# Altium project FBK Controll system Project.PrjPcb
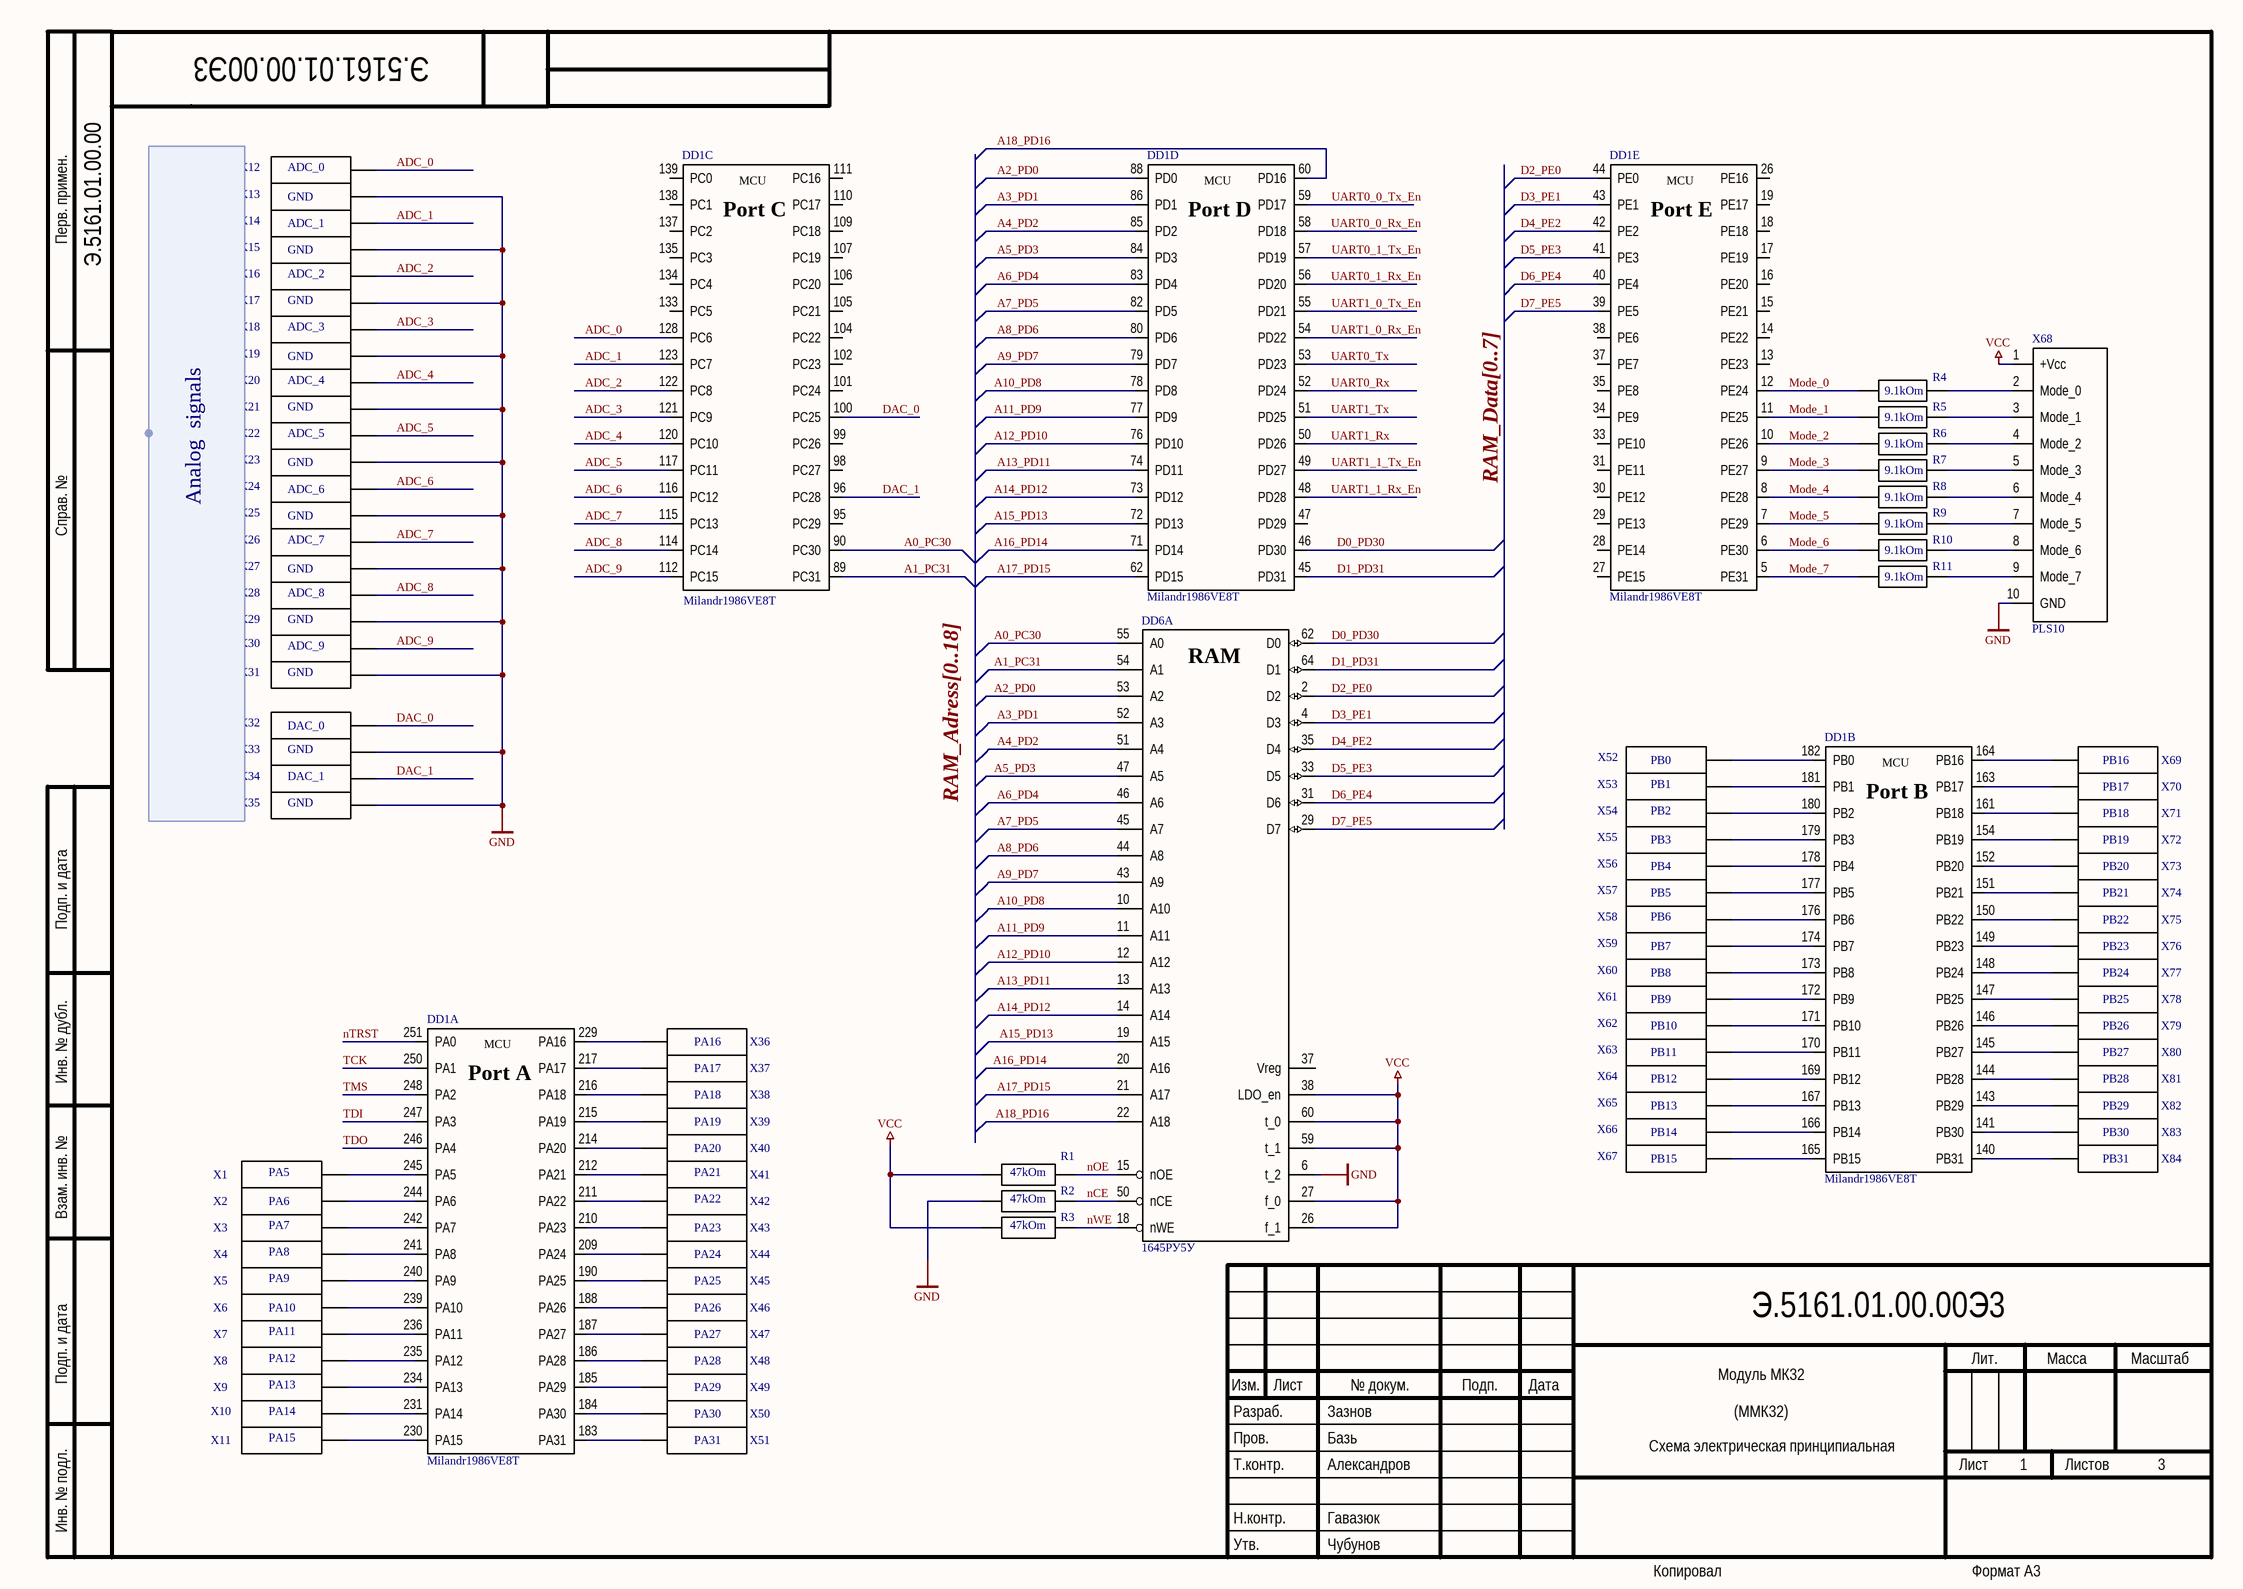
[diagram p0: MK32.SchDoc]
3 sheets, 248 parts. Net scope: global (net labels, ports and power ports of the same name join across sheets).
Board file: MK32.PcbDoc
Sheets:
  MK32.SchDoc
  MK32_2.SchDoc
  MK32_3.SchDoc

## Sheet MK32.SchDoc: Модуль МК32
size 420 x 297 mm; ApprovedBy: Чубунов; CheckedBy: Базь; Author: Зазнов; DocumentNumber: Э.5161.01.00.00Э3; SheetNumber: 1; SheetTotal: 3; NormInspection: Гавазюк; ProcessInspection: Александров; Title2str: (ММК32); DocumentType: Схема электрическая принципиальная; FirstReferrence: Э.5161.01.00.00

### Parts
(Parts that share a designator on the sheet are numbered #1, #2 ... from top to bottom, then left to right.)
DD1#1  Milandr1986VE8T  [4244.256-3]  (parts A,B,C,D,E of 6)
DD6  1645РУ5У  [5134.64-6]  (part A of 2)
R1  47kOm  [C 0603]
R2  47kOm  [C 0603]
R3  47kOm  [C 0603]
R4  9.1kOm  [C 0603]
R5  9.1kOm  [C 0603]
R6  9.1kOm  [C 0603]
R7  9.1kOm  [C 0603]
R8  9.1kOm  [C 0603]
R9  9.1kOm  [C 0603]
R10  9.1kOm  [C 0603]
R11  9.1kOm  [C 0603]
X1  PA5  [PL]
X2  PA6  [PL]
X3  PA7  [PL]
X4  PA8  [PL]
X5  PA9  [PL]
X6  PA10  [PL]
X7  PA11  [PL]
X8  PA12  [PL]
X9  PA13  [PL]
X10  PA14  [PL]
X11  PA15  [PL]
X12  ADC_0  [PL]
X13  GND  [PL]
X14  ADC_1  [PL]
X15  GND  [PL]
X16  ADC_2  [PL]
X17  GND  [PL]
X18  ADC_3  [PL]
X19  GND  [PL]
X20  ADC_4  [PL]
X21  GND  [PL]
X22  ADC_5  [PL]
X23  GND  [PL]
X24  ADC_6  [PL]
X25  GND  [PL]
X26  ADC_7  [PL]
X27  GND  [PL]
X28  ADC_8  [PL]
X29  GND  [PL]
X30  ADC_9  [PL]
X31  GND  [PL]
X32  DAC_0  [PL]
X33  GND  [PL]
X34  DAC_1  [PL]
X35  GND  [PL]
X36  PA16  [PL]
X37  PA17  [PL]
X38  PA18  [PL]
X39  PA19  [PL]
X40  PA20  [PL]
X41  PA21  [PL]
X42  PA22  [PL]
X43  PA23  [PL]
X44  PA24  [PL]
X45  PA25  [PL]
X46  PA26  [PL]
X47  PA27  [PL]
X48  PA28  [PL]
X49  PA29  [PL]
X50  PA30  [PL]
X51  PA31  [PL]
X52  PB0  [PL]
X53  PB1  [PL]
X54  PB2  [PL]
X55  PB3  [PL]
X56  PB4  [PL]
X57  PB5  [PL]
X58  PB6  [PL]
X59  PB7  [PL]
X60  PB8  [PL]
X61  PB9  [PL]
X62  PB10  [PL]
X63  PB11  [PL]
X64  PB12  [PL]
X65  PB13  [PL]
X66  PB14  [PL]
X67  PB15  [PL]
X68  PLS10  [PLS10]
X69  PB16  [PL]
X70  PB17  [PL]
X71  PB18  [PL]
X72  PB19  [PL]
X73  PB20  [PL]
X74  PB21  [PL]
X75  PB22  [PL]
X76  PB23  [PL]
X77  PB24  [PL]
X78  PB25  [PL]
X79  PB26  [PL]
X80  PB27  [PL]
X81  PB28  [PL]
X82  PB29  [PL]
X83  PB30  [PL]
X84  PB31  [PL]

### Harnesses
Analog  signals: 

### Nets
GND: DD6.6(t_2) R2.2 X13.?1(name) X15.?1(name) X17.?1(name) X19.?1(name) X21.?1(name) X23.?1(name) X25.?1(name) X27.?1(name) X29.?1(name) X31.?1(name) X33.?1(name) X35.?1(name) X68.10(GND)
VCC: DD6.26(f_1) DD6.27(f_0) DD6.38(LDO_en) DD6.59(t_1) DD6.60(t_0) R1.2 R3.2 X68.1(+Vcc)
A0_PC30: DD1#1.90(PC30) DD6.55(A0)
A1_PC31: DD1#1.89(PC31) DD6.54(A1)
A2_PD0: DD1#1.88(PD0) DD6.53(A2)
A3_PD1: DD1#1.86(PD1) DD6.52(A3)
A4_PD2: DD1#1.85(PD2) DD6.51(A4)
A5_PD3: DD1#1.84(PD3) DD6.47(A5)
A6_PD4: DD1#1.83(PD4) DD6.46(A6)
A7_PD5: DD1#1.82(PD5) DD6.45(A7)
A8_PD6: DD1#1.80(PD6) DD6.44(A8)
A9_PD7: DD1#1.79(PD7) DD6.43(A9)
A10_PD8: DD1#1.78(PD8) DD6.10(A10)
A11_PD9: DD1#1.77(PD9) DD6.11(A11)
A12_PD10: DD1#1.76(PD10) DD6.12(A12)
A13_PD11: DD1#1.74(PD11) DD6.13(A13)
A14_PD12: DD1#1.73(PD12) DD6.14(A14)
A15_PD13: DD1#1.72(PD13) DD6.19(A15)
A16_PD14: DD1#1.71(PD14) DD6.20(A16)
A17_PD15: DD1#1.62(PD15) DD6.21(A17)
A18_PD16: DD1#1.60(PD16) DD6.22(A18)
ADC_0: DD1#1.128(PC6) X12.?1(name)
ADC_1: DD1#1.123(PC7) X14.?1(name)
ADC_2: DD1#1.122(PC8) X16.?1(name)
ADC_3: DD1#1.121(PC9) X18.?1(name)
ADC_4: DD1#1.120(PC10) X20.?1(name)
ADC_5: DD1#1.117(PC11) X22.?1(name)
ADC_6: DD1#1.116(PC12) X24.?1(name)
ADC_7: DD1#1.115(PC13) X26.?1(name)
ADC_8: DD1#1.114(PC14) X28.?1(name)
ADC_9: DD1#1.112(PC15) X30.?1(name)
D0_PD30: DD1#1.46(PD30) DD6.62(D0)
D1_PD31: DD1#1.45(PD31) DD6.64(D1)
D2_PE0: DD1#1.44(PE0) DD6.2(D2)
D3_PE1: DD1#1.43(PE1) DD6.4(D3)
D4_PE2: DD1#1.42(PE2) DD6.35(D4)
D5_PE3: DD1#1.41(PE3) DD6.33(D5)
D6_PE4: DD1#1.40(PE4) DD6.31(D6)
D7_PE5: DD1#1.39(PE5) DD6.29(D7)
DAC_0: DD1#1.100(PC25) X32.?1(name)
DAC_1: DD1#1.96(PC28) X34.?1(name)
Mode_0: DD1#1.12(PE24) R4.1
Mode_1: DD1#1.11(PE25) R5.1
Mode_2: DD1#1.10(PE26) R6.1
Mode_3: DD1#1.9(PE27) R7.1
Mode_4: DD1#1.8(PE28) R8.1
Mode_5: DD1#1.7(PE29) R9.1
Mode_6: DD1#1.6(PE30) R10.1
Mode_7: DD1#1.5(PE31) R11.1
nCE: DD6.50(nCE) R2.1
nOE: DD6.15(nOE) R1.1
nTRST: DD1#1.251(PA0)
nWE: DD6.18(nWE) R3.1
TCK: DD1#1.250(PA1)
TDI: DD1#1.247(PA3)
TDO: DD1#1.246(PA4)
TMS: DD1#1.248(PA2)
UART0_0_Rx_En: DD1#1.58(PD18)
UART0_0_Tx_En: DD1#1.59(PD17)
UART0_1_Rx_En: DD1#1.56(PD20)
UART0_1_Tx_En: DD1#1.57(PD19)
UART0_Rx: DD1#1.52(PD24)
UART0_Tx: DD1#1.53(PD23)
UART1_0_Rx_En: DD1#1.54(PD22)
UART1_0_Tx_En: DD1#1.55(PD21)
UART1_1_Rx_En: DD1#1.48(PD28)
UART1_1_Tx_En: DD1#1.49(PD27)
UART1_Rx: DD1#1.50(PD26)
UART1_Tx: DD1#1.51(PD25)
NetDD1#1_140: DD1#1.140(PB31) X84.?1(name)
NetDD1#1_141: DD1#1.141(PB30) X83.?1(name)
NetDD1#1_143: DD1#1.143(PB29) X82.?1(name)
NetDD1#1_144: DD1#1.144(PB28) X81.?1(name)
NetDD1#1_145: DD1#1.145(PB27) X80.?1(name)
NetDD1#1_146: DD1#1.146(PB26) X79.?1(name)
NetDD1#1_147: DD1#1.147(PB25) X78.?1(name)
NetDD1#1_148: DD1#1.148(PB24) X77.?1(name)
NetDD1#1_149: DD1#1.149(PB23) X76.?1(name)
NetDD1#1_150: DD1#1.150(PB22) X75.?1(name)
NetDD1#1_151: DD1#1.151(PB21) X74.?1(name)
NetDD1#1_152: DD1#1.152(PB20) X73.?1(name)
NetDD1#1_154: DD1#1.154(PB19) X72.?1(name)
NetDD1#1_161: DD1#1.161(PB18) X71.?1(name)
NetDD1#1_163: DD1#1.163(PB17) X70.?1(name)
NetDD1#1_164: DD1#1.164(PB16) X69.?1(name)
NetDD1#1_165: DD1#1.165(PB15) X67.?1(name)
NetDD1#1_166: DD1#1.166(PB14) X66.?1(name)
NetDD1#1_167: DD1#1.167(PB13) X65.?1(name)
NetDD1#1_169: DD1#1.169(PB12) X64.?1(name)
NetDD1#1_170: DD1#1.170(PB11) X63.?1(name)
NetDD1#1_171: DD1#1.171(PB10) X62.?1(name)
NetDD1#1_172: DD1#1.172(PB9) X61.?1(name)
NetDD1#1_173: DD1#1.173(PB8) X60.?1(name)
NetDD1#1_174: DD1#1.174(PB7) X59.?1(name)
NetDD1#1_176: DD1#1.176(PB6) X58.?1(name)
NetDD1#1_177: DD1#1.177(PB5) X57.?1(name)
NetDD1#1_178: DD1#1.178(PB4) X56.?1(name)
NetDD1#1_179: DD1#1.179(PB3) X55.?1(name)
NetDD1#1_180: DD1#1.180(PB2) X54.?1(name)
NetDD1#1_181: DD1#1.181(PB1) X53.?1(name)
NetDD1#1_182: DD1#1.182(PB0) X52.?1(name)
NetDD1#1_183: DD1#1.183(PA31) X51.?1(name)
NetDD1#1_184: DD1#1.184(PA30) X50.?1(name)
NetDD1#1_185: DD1#1.185(PA29) X49.?1(name)
NetDD1#1_186: DD1#1.186(PA28) X48.?1(name)
NetDD1#1_187: DD1#1.187(PA27) X47.?1(name)
NetDD1#1_188: DD1#1.188(PA26) X46.?1(name)
NetDD1#1_190: DD1#1.190(PA25) X45.?1(name)
NetDD1#1_209: DD1#1.209(PA24) X44.?1(name)
NetDD1#1_210: DD1#1.210(PA23) X43.?1(name)
NetDD1#1_211: DD1#1.211(PA22) X42.?1(name)
NetDD1#1_212: DD1#1.212(PA21) X41.?1(name)
NetDD1#1_214: DD1#1.214(PA20) X40.?1(name)
NetDD1#1_215: DD1#1.215(PA19) X39.?1(name)
NetDD1#1_216: DD1#1.216(PA18) X38.?1(name)
NetDD1#1_217: DD1#1.217(PA17) X37.?1(name)
NetDD1#1_229: DD1#1.229(PA16) X36.?1(name)
NetDD1#1_230: DD1#1.230(PA15) X11.?1(name)
NetDD1#1_231: DD1#1.231(PA14) X10.?1(name)
NetDD1#1_234: DD1#1.234(PA13) X9.?1(name)
NetDD1#1_235: DD1#1.235(PA12) X8.?1(name)
NetDD1#1_236: DD1#1.236(PA11) X7.?1(name)
NetDD1#1_239: DD1#1.239(PA10) X6.?1(name)
NetDD1#1_240: DD1#1.240(PA9) X5.?1(name)
NetDD1#1_241: DD1#1.241(PA8) X4.?1(name)
NetDD1#1_242: DD1#1.242(PA7) X3.?1(name)
NetDD1#1_244: DD1#1.244(PA6) X2.?1(name)
NetDD1#1_245: DD1#1.245(PA5) X1.?1(name)
NetR4_2: R4.2 X68.2(Mode_0)
NetR5_2: R5.2 X68.3(Mode_1)
NetR6_2: R6.2 X68.4(Mode_2)
NetR7_2: R7.2 X68.5(Mode_3)
NetR8_2: R8.2 X68.6(Mode_4)
NetR9_2: R9.2 X68.7(Mode_5)
NetR10_2: R10.2 X68.8(Mode_6)
NetR11_2: R11.2 X68.9(Mode_7)

Not connected (* = marked no-connect by the designer): DD1#1 13(PE23) 14(PE22) 15(PE21) 16(PE20) 17(PE19) 18(PE18) 19(PE17) 26(PE16) 27(PE15) 28(PE14) 29(PE13) 30(PE12) 31(PE11) 33(PE10) 34(PE9) 35(PE8) 37(PE7) 38(PE6) 47(PD29) 95(PC29) 98(PC27) 99(PC26) 101(PC24) 102(PC23) 104(PC22) 105(PC21) 106(PC20) 107(PC19) 109(PC18) 110(PC17) 111(PC16) 133(PC5) 134(PC4) 135(PC3) 137(PC2) 138(PC1) 139(PC0); DD6 37(Vreg)

### Buses and harness runs
bus RAM_Adress[0..18]
bus RAM_Data[0..7]

### Notes on the sheet
- Labels drawn without touching a wire or pin: RAM_Adress[0..18]
- Перв. примен.
- Справ. №
- Подп. и дата
- Инв. № дубл.
- Взам. инв. №
- Разраб.
- Изм.
- Лист
- № докум.
- Подп.
- Дата
- Лит.
- Масса
- Масштаб
- Пров.
- Т.контр.
- Листов
- Инв. № подл.
- Утв.
- Н.контр.
- Копировал
- Формат А3
- (in symbol 1645РУ5У, part A) RAM
- (in symbol Milandr1986VE8T, part A) MCU; Port A
- (in symbol Milandr1986VE8T, part B) MCU; Port B
- (in symbol Milandr1986VE8T, part C) MCU; Port C
- (in symbol Milandr1986VE8T, part D) MCU; Port D
- (in symbol Milandr1986VE8T, part E) MCU; Port E

### Library data of the parts
R1-R11 = R0603
X1-X67 X69-X84 = PL
DD1#1 = Milandr1986VE8T: Parameter 1: *

## Sheet MK32_2.SchDoc
size 420 x 297 mm
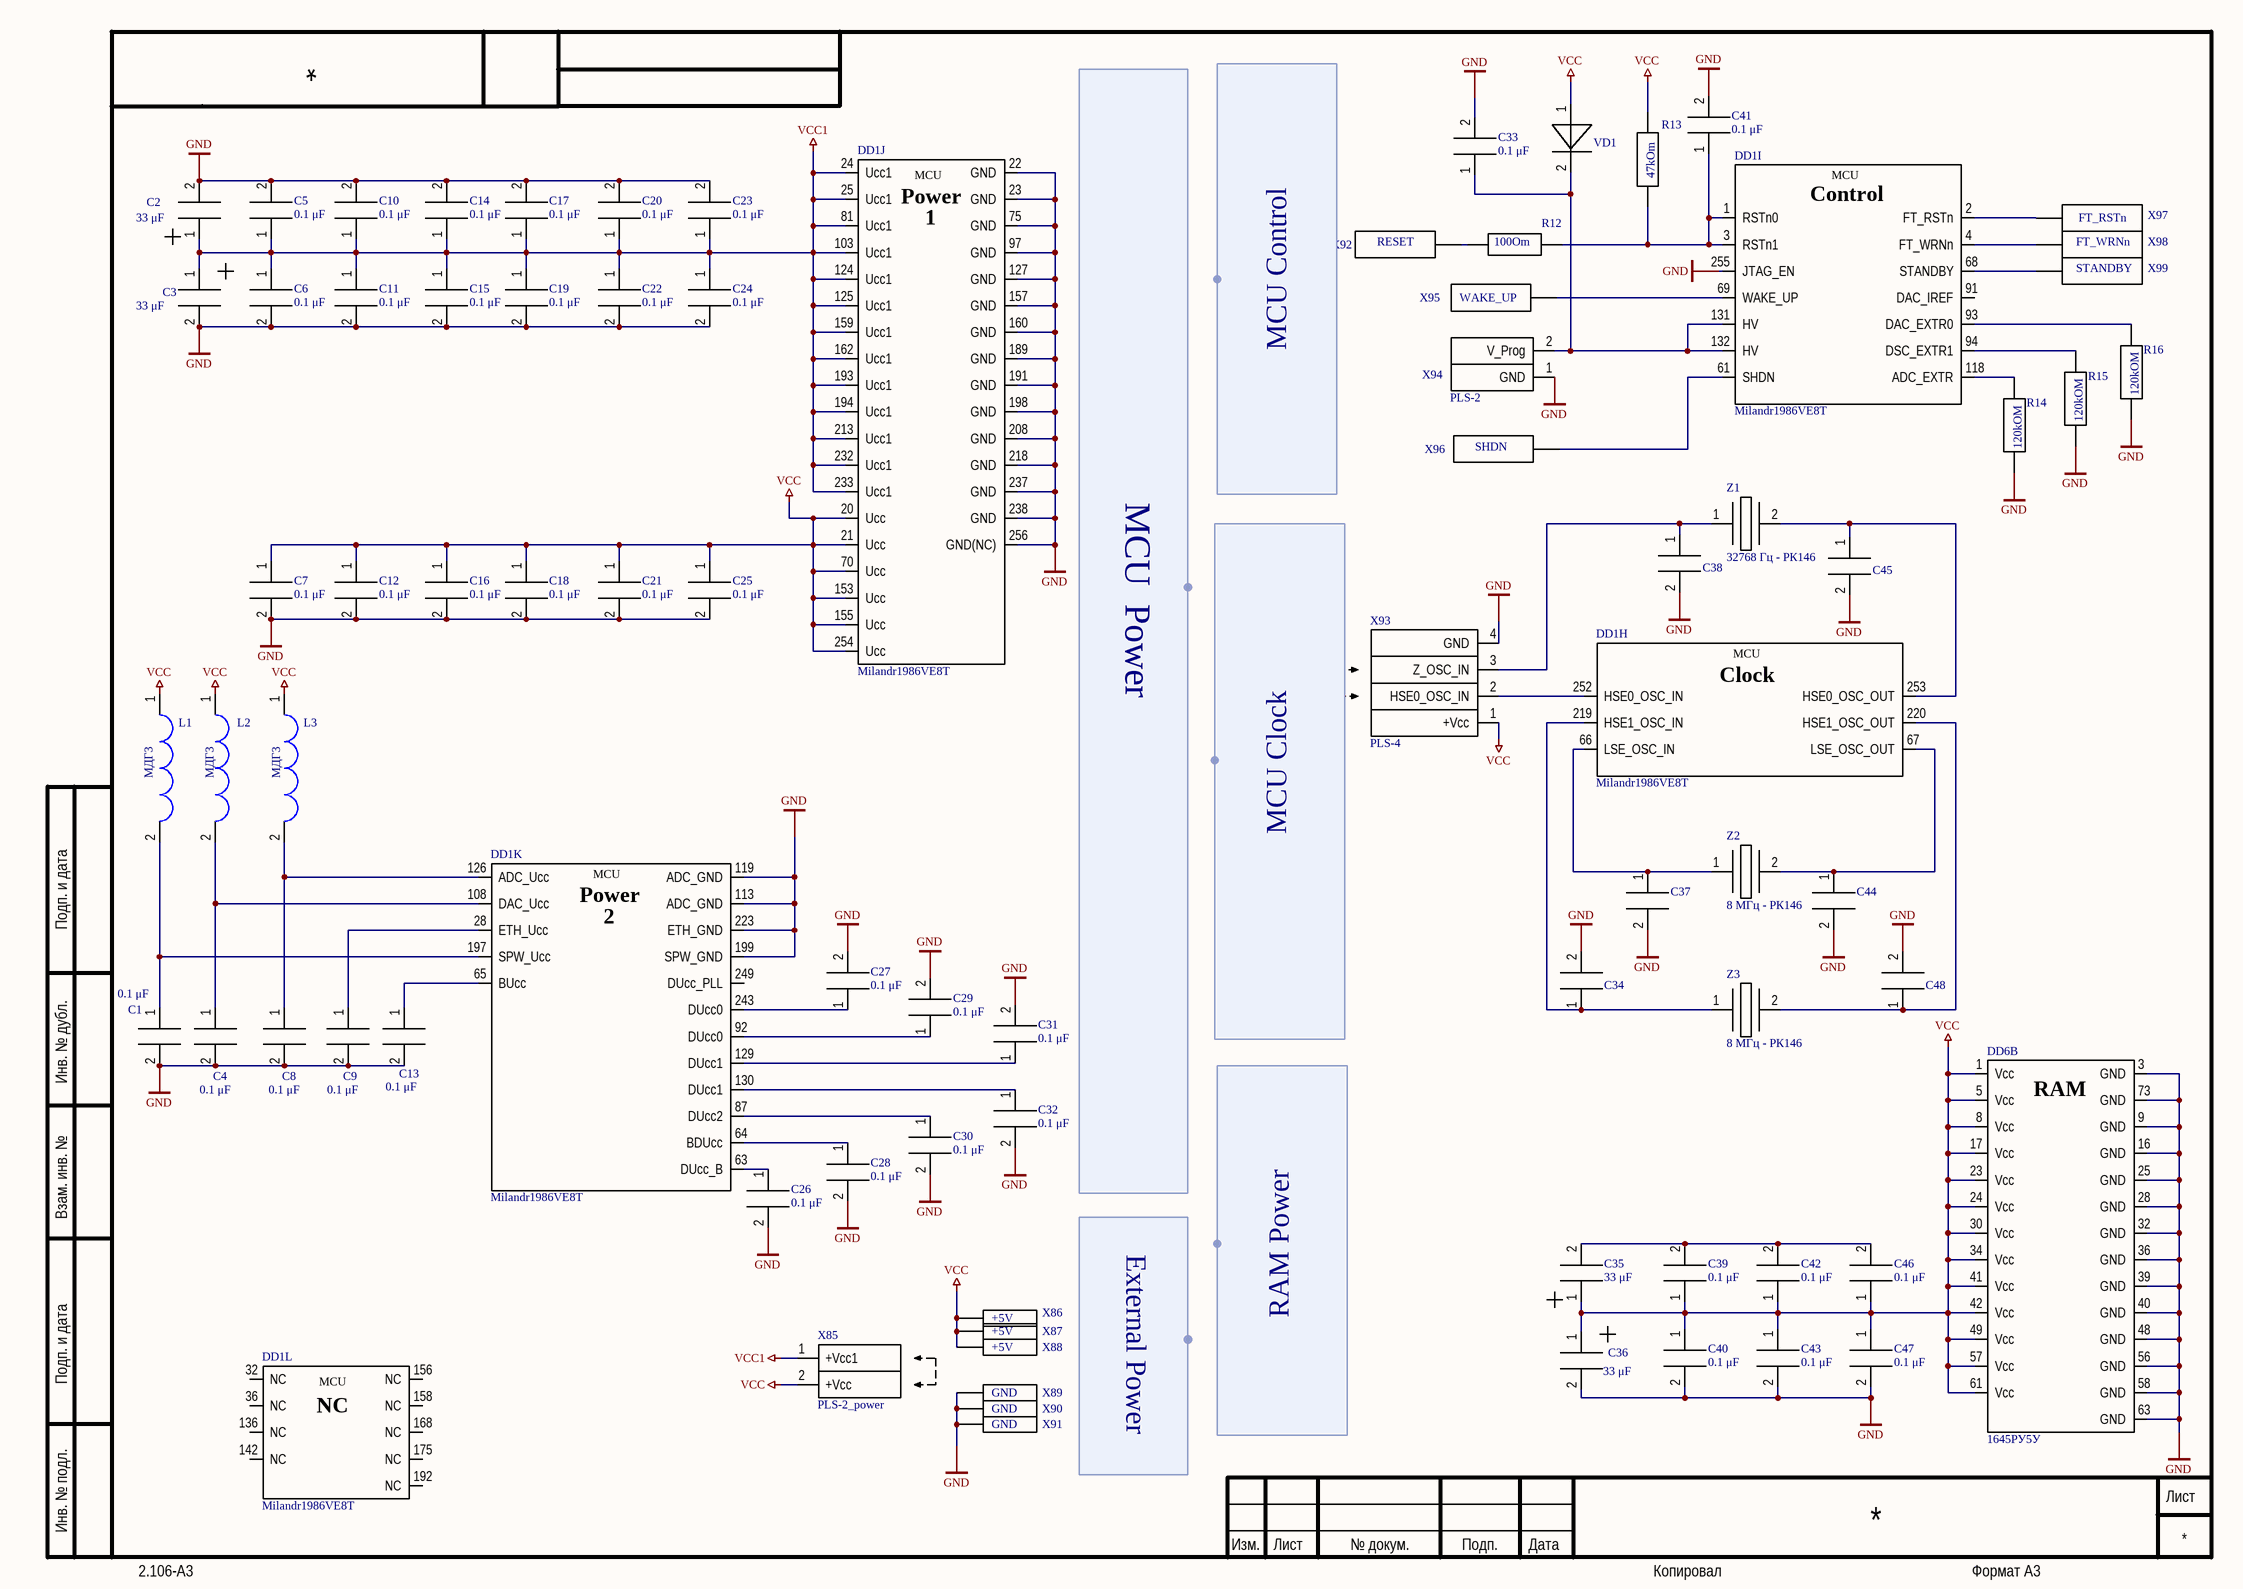
[diagram p1: MK32_2.SchDoc]

### Parts
(Parts that share a designator on the sheet are numbered #1, #2 ... from top to bottom, then left to right.)
C1  0.1 μF  [C 0603]
C2  33 μF
C3  33 μF
C4  0.1 μF  [C 0603]
C5  0.1 μF  [C 0603]
C6  0.1 μF  [C 0603]
C7  0.1 μF  [C 0603]
C8  0.1 μF  [C 0603]
C9  0.1 μF  [C 0603]
C10  0.1 μF  [C 0603]
C11  0.1 μF  [C 0603]
C12  0.1 μF  [C 0603]
C13  0.1 μF  [C 0603]
C14  0.1 μF  [C 0603]
C15  0.1 μF  [C 0603]
C16  0.1 μF  [C 0603]
C17  0.1 μF  [C 0603]
C18  0.1 μF  [C 0603]
C19  0.1 μF  [C 0603]
C20  0.1 μF  [C 0603]
C21  0.1 μF  [C 0603]
C22  0.1 μF  [C 0603]
C23  0.1 μF  [C 0603]
C24  0.1 μF  [C 0603]
C25  0.1 μF  [C 0603]
C26  0.1 μF  [C 0603]
C27  0.1 μF  [C 0603]
C28  0.1 μF  [C 0603]
C29  0.1 μF  [C 0603]
C30  0.1 μF  [C 0603]
C31  0.1 μF  [C 0603]
C32  0.1 μF  [C 0603]
C33  0.1 μF  [C 0603]
C34  C 0603  [C 0603]  (value not drawn)
C35  33 μF
C36  33 μF
C37  C 0603  [C 0603]  (value not drawn)
C38  C 0603  [C 0603]  (value not drawn)
C39  0.1 μF  [C 0603]
C40  0.1 μF  [C 0603]
C41  0.1 μF  [C 0603]
C42  0.1 μF  [C 0603]
C43  0.1 μF  [C 0603]
C44  C 0603  [C 0603]  (value not drawn)
C45  C 0603  [C 0603]  (value not drawn)
C46  0.1 μF  [C 0603]
C47  0.1 μF  [C 0603]
C48  C 0603  [C 0603]  (value not drawn)
DD1#2  Milandr1986VE8T  [4244.256-3]  (part J of 10)
DD1#3  Milandr1986VE8T  [4244.256-3]  (part I of 9)
DD1#4  Milandr1986VE8T  [4244.256-3]  (part H of 8)
DD1#5  Milandr1986VE8T  [4244.256-3]  (part K of 11)
DD1#6  Milandr1986VE8T  [4244.256-3]  (part L of 12)
DD6  1645РУ5У  [5134.64-6]  (part B of 2)
L1  МДГ3  [МДГ3]
L2  МДГ3  [МДГ3]
L3  МДГ3  [МДГ3]
R12  100Om  [C 0603]
R13  47kOm  [C 0603]
R14  120kOM  [C 0603]
R15  120kOM  [C 0603]
R16  120kOM  [C 0603]
VD1  2Д510А  [2Д510А]  (value not drawn)
X85  PLS-2_power  [pls2]
X86  +5V  [PL]
X87  +5V  [PL]
X88  +5V  [PL]
X89  GND  [PL]
X90  GND  [PL]
X91  GND  [PL]
X92  RESET  [PL]
X93  PLS-4  [pls4]
X94  PLS-2  [pls2]
X95  WAKE_UP  [PL]
X96  SHDN  [PL]
X97  FT_RSTn  [PL]
X98  FT_WRNn  [PL]
X99  STANDBY  [PL]
Z1  32768 Гц - РК146  [РК146]
Z2  8 МГц - РК146  [РК146]
Z3  8 МГц - РК146  [РК146]

### Harnesses
MCU  Power: 
MCU Control: 
MCU Clock: 
RAM Power: 
External Power: 

### Nets
GND: C1.2 C2.2 C3.2 C4.2 C5.2 C6.2 C7.2 C8.2 C9.2 C10.2 C11.2 C12.2 C13.2 C14.2 C15.2 C16.2 C17.2 C18.2 C19.2 C20.2 C21.2 C22.2 C23.2 C24.2 C25.2 C26.2 C27.2 C28.2 C29.2 C30.2 C31.2 C32.2 C33.2 C34.2 C36.2 C37.2 C38.2 C40.2 C41.2 C43.2 C44.2 C45.2 C47.2 C48.2 DD1#2.22(GND) DD1#2.23(GND) DD1#2.75(GND) DD1#2.97(GND) DD1#2.127(GND) DD1#2.157(GND) DD1#2.160(GND) DD1#2.189(GND) DD1#2.191(GND) DD1#2.198(GND) DD1#2.208(GND) DD1#2.218(GND) DD1#2.237(GND) DD1#2.238(GND) DD1#2.256(GND(NC)) DD1#3.255(JTAG_EN) DD1#5.113(ADC_GND) DD1#5.119(ADC_GND) DD1#5.199(SPW_GND) DD1#5.223(ETH_GND) DD6.3(GND) DD6.9(GND) DD6.16(GND) DD6.25(GND) DD6.28(GND) DD6.32(GND) DD6.36(GND) DD6.39(GND) DD6.40(GND) DD6.48(GND) DD6.56(GND) DD6.58(GND) DD6.63(GND) DD6.73(GND) R14.2 R15.2 R16.2 X89.?1(name) X90.?1(name) X91.?1(name) X93.4(GND) X94.1(GND)
VCC: C7.1 C12.1 C16.1 C18.1 C21.1 C25.1 C35.1 C36.1 C39.1 C40.1 C42.1 C43.1 C46.1 C47.1 DD1#2.20(Ucc) DD1#2.21(Ucc) DD1#2.70(Ucc) DD1#2.153(Ucc) DD1#2.155(Ucc) DD1#2.254(Ucc) DD6.1(Vcc) DD6.5(Vcc) DD6.8(Vcc) DD6.17(Vcc) DD6.23(Vcc) DD6.24(Vcc) DD6.30(Vcc) DD6.34(Vcc) DD6.41(Vcc) DD6.42(Vcc) DD6.49(Vcc) DD6.57(Vcc) DD6.61(Vcc) L1.1 L2.1 L3.1 R13.2 VD1.1 X85.2(+Vcc) X86.?1(name) X87.?1(name) X88.?1(name) X93.1(+Vcc)
VCC1: C2.1 C3.1 C5.1 C6.1 C10.1 C11.1 C14.1 C15.1 C17.1 C19.1 C20.1 C22.1 C23.1 C24.1 DD1#2.24(Ucc1) DD1#2.25(Ucc1) DD1#2.81(Ucc1) DD1#2.103(Ucc1) DD1#2.124(Ucc1) DD1#2.125(Ucc1) DD1#2.159(Ucc1) DD1#2.162(Ucc1) DD1#2.193(Ucc1) DD1#2.194(Ucc1) DD1#2.213(Ucc1) DD1#2.232(Ucc1) DD1#2.233(Ucc1) X85.1(+Vcc1)
NetC1_1: C1.1 DD1#5.197(SPW_Ucc) L1.2
NetC4_1: C4.1 DD1#5.108(DAC_Ucc) L2.2
NetC8_1: C8.1 DD1#5.126(ADC_Ucc) L3.2
NetC9_1: C9.1 DD1#5.28(ETH_Ucc)
NetC13_1: C13.1 DD1#5.65(BUcc)
NetC26_1: C26.1 DD1#5.63(DUcc_B)
NetC27_1: C27.1 DD1#5.243(DUcc0)
NetC28_1: C28.1 DD1#5.64(BDUcc)
NetC29_1: C29.1 DD1#5.92(DUcc0)
NetC30_1: C30.1 DD1#5.87(DUcc2)
NetC31_1: C31.1 DD1#5.129(DUcc1)
NetC32_1: C32.1 DD1#5.130(DUcc1)
NetC33_1: C33.1 DD1#3.131(HV) DD1#3.132(HV) VD1.2 X94.2(V_Prog)
NetC34_1: C34.1 DD1#4.219(HSE1_OSC_IN) Z3.1
NetC35_2: C35.2 C39.2 C42.2 C46.2
NetC37_1: C37.1 DD1#4.66(LSE_OSC_IN) Z2.1
NetC38_1: C38.1 X93.3(Z_OSC_IN) Z1.1
NetC41_1: C41.1 DD1#3.1(RSTn0) DD1#3.3(RSTn1) R12.2 R13.1
NetC44_1: C44.1 DD1#4.67(LSE_OSC_OUT) Z2.2
NetC45_1: C45.1 DD1#4.253(HSE0_OSC_OUT) Z1.2
NetC48_1: C48.1 DD1#4.220(HSE1_OSC_OUT) Z3.2
NetDD1#3_2: DD1#3.2(FT_RSTn) X97.?1(name)
NetDD1#3_4: DD1#3.4(FT_WRNn) X98.?1(name)
NetDD1#3_61: DD1#3.61(SHDN) X96.?1(name)
NetDD1#3_68: DD1#3.68(STANDBY) X99.?1(name)
NetDD1#3_69: DD1#3.69(WAKE_UP) X95.?1(name)
NetDD1#3_93: DD1#3.93(DAC_EXTR0) R16.1
NetDD1#3_94: DD1#3.94(DSC_EXTR1) R15.1
NetDD1#3_118: DD1#3.118(ADC_EXTR) R14.1
NetDD1#4_252: DD1#4.252(HSE0_OSC_IN) X93.2(HSE0_OSC_IN)
NetR12_1: R12.1 X92.?1(name)

Not connected (* = marked no-connect by the designer): DD1#3 91(DAC_IREF); DD1#5 249(DUcc_PLL); DD1#6 32(NC) 36(NC) 136(NC) 142(NC) 156(NC) 158(NC) 168(NC) 175(NC) 192(NC)

### Notes on the sheet
- Подп. и дата
- Инв. № дубл.
- Взам. инв. №
- Инв. № подл.
- Изм.
- Лист
- № докум.
- Подп.
- Дата
- 2.106-A3
- Копировал
- Формат А3
- (in symbol 1645РУ5У, part B) RAM
- (in symbol Milandr1986VE8T, part H) MCU; Clock
- (in symbol Milandr1986VE8T, part I) MCU; Control
- (in symbol Milandr1986VE8T, part J) MCU; Power
- (in symbol Milandr1986VE8T, part K) MCU; Power
- (in symbol Milandr1986VE8T, part L) MCU

### Library data of the parts
C1 C4-C33 C39-C43 C46 C47 = C 0603
C2 C3 C35 C36 = C К53-68С(тантал С)
R12-R16 = R0603
X86-X92 X95-X99 = PL
Z1-Z3 = РК146
DD1#2-DD1#6 = Milandr1986VE8T: Parameter 1: *

## Sheet MK32_3.SchDoc
size 420 x 297 mm; DocumentNumber: Э.5161.01.00.00Э3; SheetNumber: 3
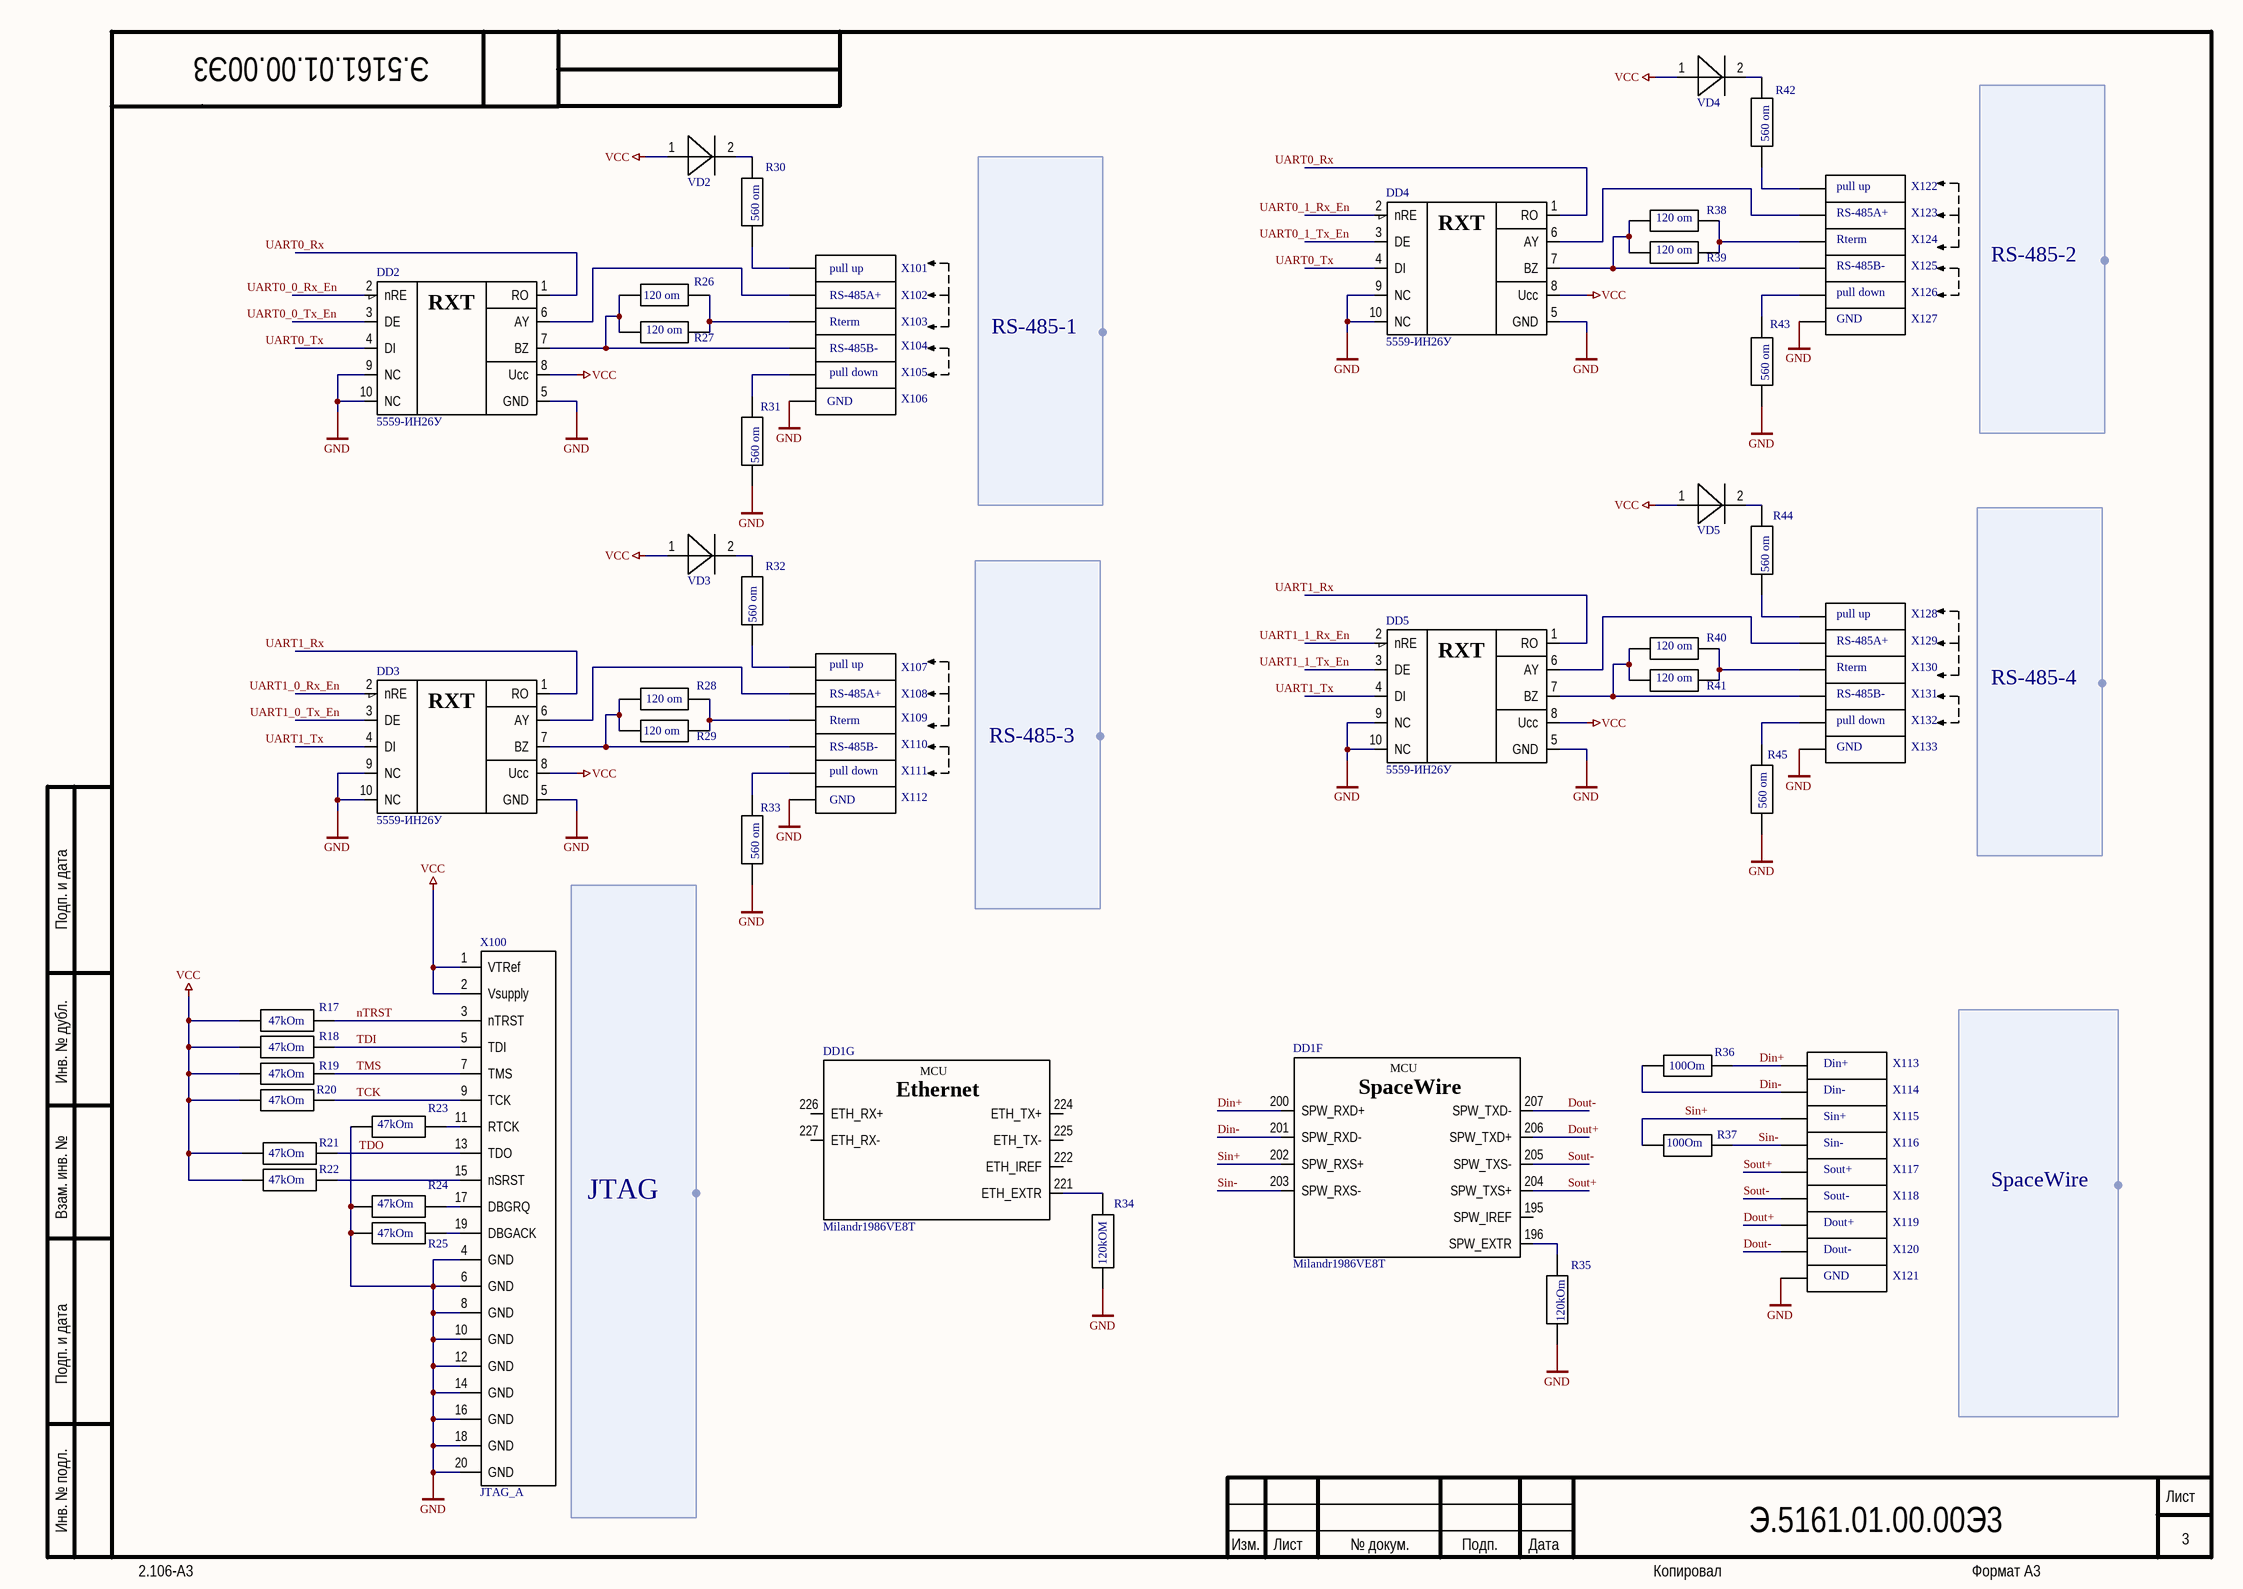
[diagram p2: MK32_3.SchDoc]

### Parts
(Parts that share a designator on the sheet are numbered #1, #2 ... from top to bottom, then left to right.)
DD1#1  Milandr1986VE8T  [4244.256-3]  (part F of 6)
DD1#4  Milandr1986VE8T  [4244.256-3]  (part G of 8)
DD2  5559-ИН26У  [H02.2-1-B]
DD3  5559-ИН26У  [H02.2-1-B]
DD4  5559-ИН26У  [H02.2-1-B]
DD5  5559-ИН26У  [H02.2-1-B]
R17  47kOm  [C 0603]
R18  47kOm  [C 0603]
R19  47kOm  [C 0603]
R20  47kOm  [C 0603]
R21  47kOm  [C 0603]
R22  47kOm  [C 0603]
R23  47kOm  [C 0603]
R24  47kOm  [C 0603]
R25  47kOm  [C 0603]
R26  120 om  [R1206]
R27  120 om  [R1206]
R28  120 om  [R1206]
R29  120 om  [R1206]
R30  560 om  [R1206]
R31  560 om  [R1206]
R32  560 om  [R1206]
R33  560 om  [R1206]
R34  120kOM  [C 0603]
R35  120kOm  [C 0603]
R36  100Om  [C 0603]
R37  100Om  [C 0603]
R38  120 om  [R1206]
R39  120 om  [R1206]
R40  120 om  [R1206]
R41  120 om  [R1206]
R42  560 om  [R1206]
R43  560 om  [R1206]
R44  560 om  [R1206]
R45  560 om  [R1206]
VD2  2Д510А  [2Д510А]  (value not drawn)
VD3  2Д510А  [2Д510А]  (value not drawn)
VD4  2Д510А  [2Д510А]  (value not drawn)
VD5  2Д510А  [2Д510А]  (value not drawn)
X100  JTAG_A  [IDC-20]
X101  pull up  [PL]
X102  RS-485A+  [PL]
X103  Rterm  [PL]
X104  RS-485B-  [PL]
X105  pull down  [PL]
X106  GND  [PL]
X107  pull up  [PL]
X108  RS-485A+  [PL]
X109  Rterm  [PL]
X110  RS-485B-  [PL]
X111  pull down  [PL]
X112  GND  [PL]
X113  Din+  [PL]
X114  Din-  [PL]
X115  Sin+  [PL]
X116  Sin-  [PL]
X117  Sout+  [PL]
X118  Sout-  [PL]
X119  Dout+  [PL]
X120  Dout-  [PL]
X121  GND  [PL]
X122  pull up  [PL]
X123  RS-485A+  [PL]
X124  Rterm  [PL]
X125  RS-485B-  [PL]
X126  pull down  [PL]
X127  GND  [PL]
X128  pull up  [PL]
X129  RS-485A+  [PL]
X130  Rterm  [PL]
X131  RS-485B-  [PL]
X132  pull down  [PL]
X133  GND  [PL]

### Harnesses
RS-485-2: 
RS-485-4: 
RS-485-1: 
RS-485-3: 
JTAG: 
SpaceWire: 

### Nets
GND: DD2.5(GND) DD2.9(NC) DD2.10(NC) DD3.5(GND) DD3.9(NC) DD3.10(NC) DD4.5(GND) DD4.9(NC) DD4.10(NC) DD5.5(GND) DD5.9(NC) DD5.10(NC) R23.1 R24.1 R25.1 R31.2 R33.2 R34.2 R35.1 R43.2 R45.2 X100.4(GND) X100.6(GND) X100.8(GND) X100.10(GND) X100.12(GND) X100.14(GND) X100.16(GND) X100.18(GND) X100.20(GND) X106.?1(name) X112.?1(name) X121.?1(name) X127.?1(name) X133.?1(name)
VCC: DD2.8(Ucc) DD3.8(Ucc) DD4.8(Ucc) DD5.8(Ucc) R17.2 R18.2 R19.2 R20.2 R21.2 R22.2 VD2.1 VD3.1 VD4.1 VD5.1 X100.1(VTRef) X100.2(Vsupply)
Din+: DD1#1.200(SPW_RXD+) R36.2 X113.?1(name)
Din-: DD1#1.201(SPW_RXD-) R36.1 X114.?1(name)
Dout+: DD1#1.206(SPW_TXD+) X119.?1(name)
Dout-: DD1#1.207(SPW_TXD-) X120.?1(name)
nTRST: R17.1 X100.3(nTRST)
Sin+: DD1#1.202(SPW_RXS+) R37.1 X115.?1(name)
Sin-: DD1#1.203(SPW_RXS-) R37.2 X116.?1(name)
Sout+: DD1#1.204(SPW_TXS+) X117.?1(name)
Sout-: DD1#1.205(SPW_TXS-) X118.?1(name)
TCK: R20.1 X100.9(TCK)
TDI: R18.1 X100.5(TDI)
TDO: R21.1 X100.13(TDO)
TMS: R19.1 X100.7(TMS)
UART0_0_Rx_En: DD2.2(nRE)
UART0_0_Tx_En: DD2.3(DE)
UART0_1_Rx_En: DD4.2(nRE)
UART0_1_Tx_En: DD4.3(DE)
UART0_Rx: DD2.1(RO) DD4.1(RO)
UART0_Tx: DD2.4(DI) DD4.4(DI)
UART1_0_Rx_En: DD3.2(nRE)
UART1_0_Tx_En: DD3.3(DE)
UART1_1_Rx_En: DD5.2(nRE)
UART1_1_Tx_En: DD5.3(DE)
UART1_Rx: DD3.1(RO) DD5.1(RO)
UART1_Tx: DD3.4(DI) DD5.4(DI)
NetDD1#1_196: DD1#1.196(SPW_EXTR) R35.2
NetDD1#4_221: DD1#4.221(ETH_EXTR) R34.1
NetDD2_6: DD2.6(AY) X102.?1(name)
NetDD2_7: DD2.7(BZ) R26.2 R27.2 X104.?1(name)
NetDD3_6: DD3.6(AY) X108.?1(name)
NetDD3_7: DD3.7(BZ) R28.2 R29.2 X110.?1(name)
NetDD4_6: DD4.6(AY) X123.?1(name)
NetDD4_7: DD4.7(BZ) R38.2 R39.2 X125.?1(name)
NetDD5_6: DD5.6(AY) X129.?1(name)
NetDD5_7: DD5.7(BZ) R40.2 R41.2 X131.?1(name)
NetR22_1: R22.1 X100.15(nSRST)
NetR23_2: R23.2 X100.11(RTCK)
NetR24_2: R24.2 X100.17(DBGRQ)
NetR25_2: R25.2 X100.19(DBGACK)
NetR26_1: R26.1 R27.1 X103.?1(name)
NetR28_1: R28.1 R29.1 X109.?1(name)
NetR30_1: R30.1 VD2.2
NetR30_2: R30.2 X101.?1(name)
NetR31_1: R31.1 X105.?1(name)
NetR32_1: R32.1 VD3.2
NetR32_2: R32.2 X107.?1(name)
NetR33_1: R33.1 X111.?1(name)
NetR38_1: R38.1 R39.1 X124.?1(name)
NetR40_1: R40.1 R41.1 X130.?1(name)
NetR42_1: R42.1 VD4.2
NetR42_2: R42.2 X122.?1(name)
NetR43_1: R43.1 X126.?1(name)
NetR44_1: R44.1 VD5.2
NetR44_2: R44.2 X128.?1(name)
NetR45_1: R45.1 X132.?1(name)

Not connected (* = marked no-connect by the designer): DD1#1 195(SPW_IREF); DD1#4 222(ETH_IREF) 224(ETH_TX+) 225(ETH_TX-) 226(ETH_RX+) 227(ETH_RX-)

### Notes on the sheet
- Подп. и дата
- Инв. № дубл.
- Взам. инв. №
- Инв. № подл.
- Изм.
- Лист
- № докум.
- Подп.
- Дата
- 2.106-A3
- Копировал
- Формат А3
- (in symbol 5559-ИН26У) RXT
- (in symbol Milandr1986VE8T, part F) MCU; SpaceWire
- (in symbol Milandr1986VE8T, part G) MCU; Ethernet

### Library data of the parts
R17-R25 R34-R37 = R0603
R26-R33 R38-R45 = R1206
X100 = IDC-20
X101-X133 = PL
DD1#1 DD1#4 = Milandr1986VE8T: Parameter 1: *

## Nets that join several sheets
GND: MK32 (15 pins), MK32_2 (86 pins), MK32_3 (35 pins)
VCC: MK32 (8 pins), MK32_2 (43 pins), MK32_3 (16 pins)
nTRST: MK32 (DD1#1.251), MK32_3 (R17.1 X100.3)
TCK: MK32 (DD1#1.250), MK32_3 (R20.1 X100.9)
TDI: MK32 (DD1#1.247), MK32_3 (R18.1 X100.5)
TDO: MK32 (DD1#1.246), MK32_3 (R21.1 X100.13)
TMS: MK32 (DD1#1.248), MK32_3 (R19.1 X100.7)
UART0_0_Rx_En: MK32 (DD1#1.58), MK32_3 (DD2.2)
UART0_0_Tx_En: MK32 (DD1#1.59), MK32_3 (DD2.3)
UART0_1_Rx_En: MK32 (DD1#1.56), MK32_3 (DD4.2)
UART0_1_Tx_En: MK32 (DD1#1.57), MK32_3 (DD4.3)
UART0_Rx: MK32 (DD1#1.52), MK32_3 (DD2.1 DD4.1)
UART0_Tx: MK32 (DD1#1.53), MK32_3 (DD2.4 DD4.4)
UART1_0_Rx_En: MK32 (DD1#1.54), MK32_3 (DD3.2)
UART1_0_Tx_En: MK32 (DD1#1.55), MK32_3 (DD3.3)
UART1_1_Rx_En: MK32 (DD1#1.48), MK32_3 (DD5.2)
UART1_1_Tx_En: MK32 (DD1#1.49), MK32_3 (DD5.3)
UART1_Rx: MK32 (DD1#1.50), MK32_3 (DD3.1 DD5.1)
UART1_Tx: MK32 (DD1#1.51), MK32_3 (DD3.4 DD5.4)